# EAGLE design ethernet (EAGLE 9.6.2)

## Sheet 1 of 2: TITLE
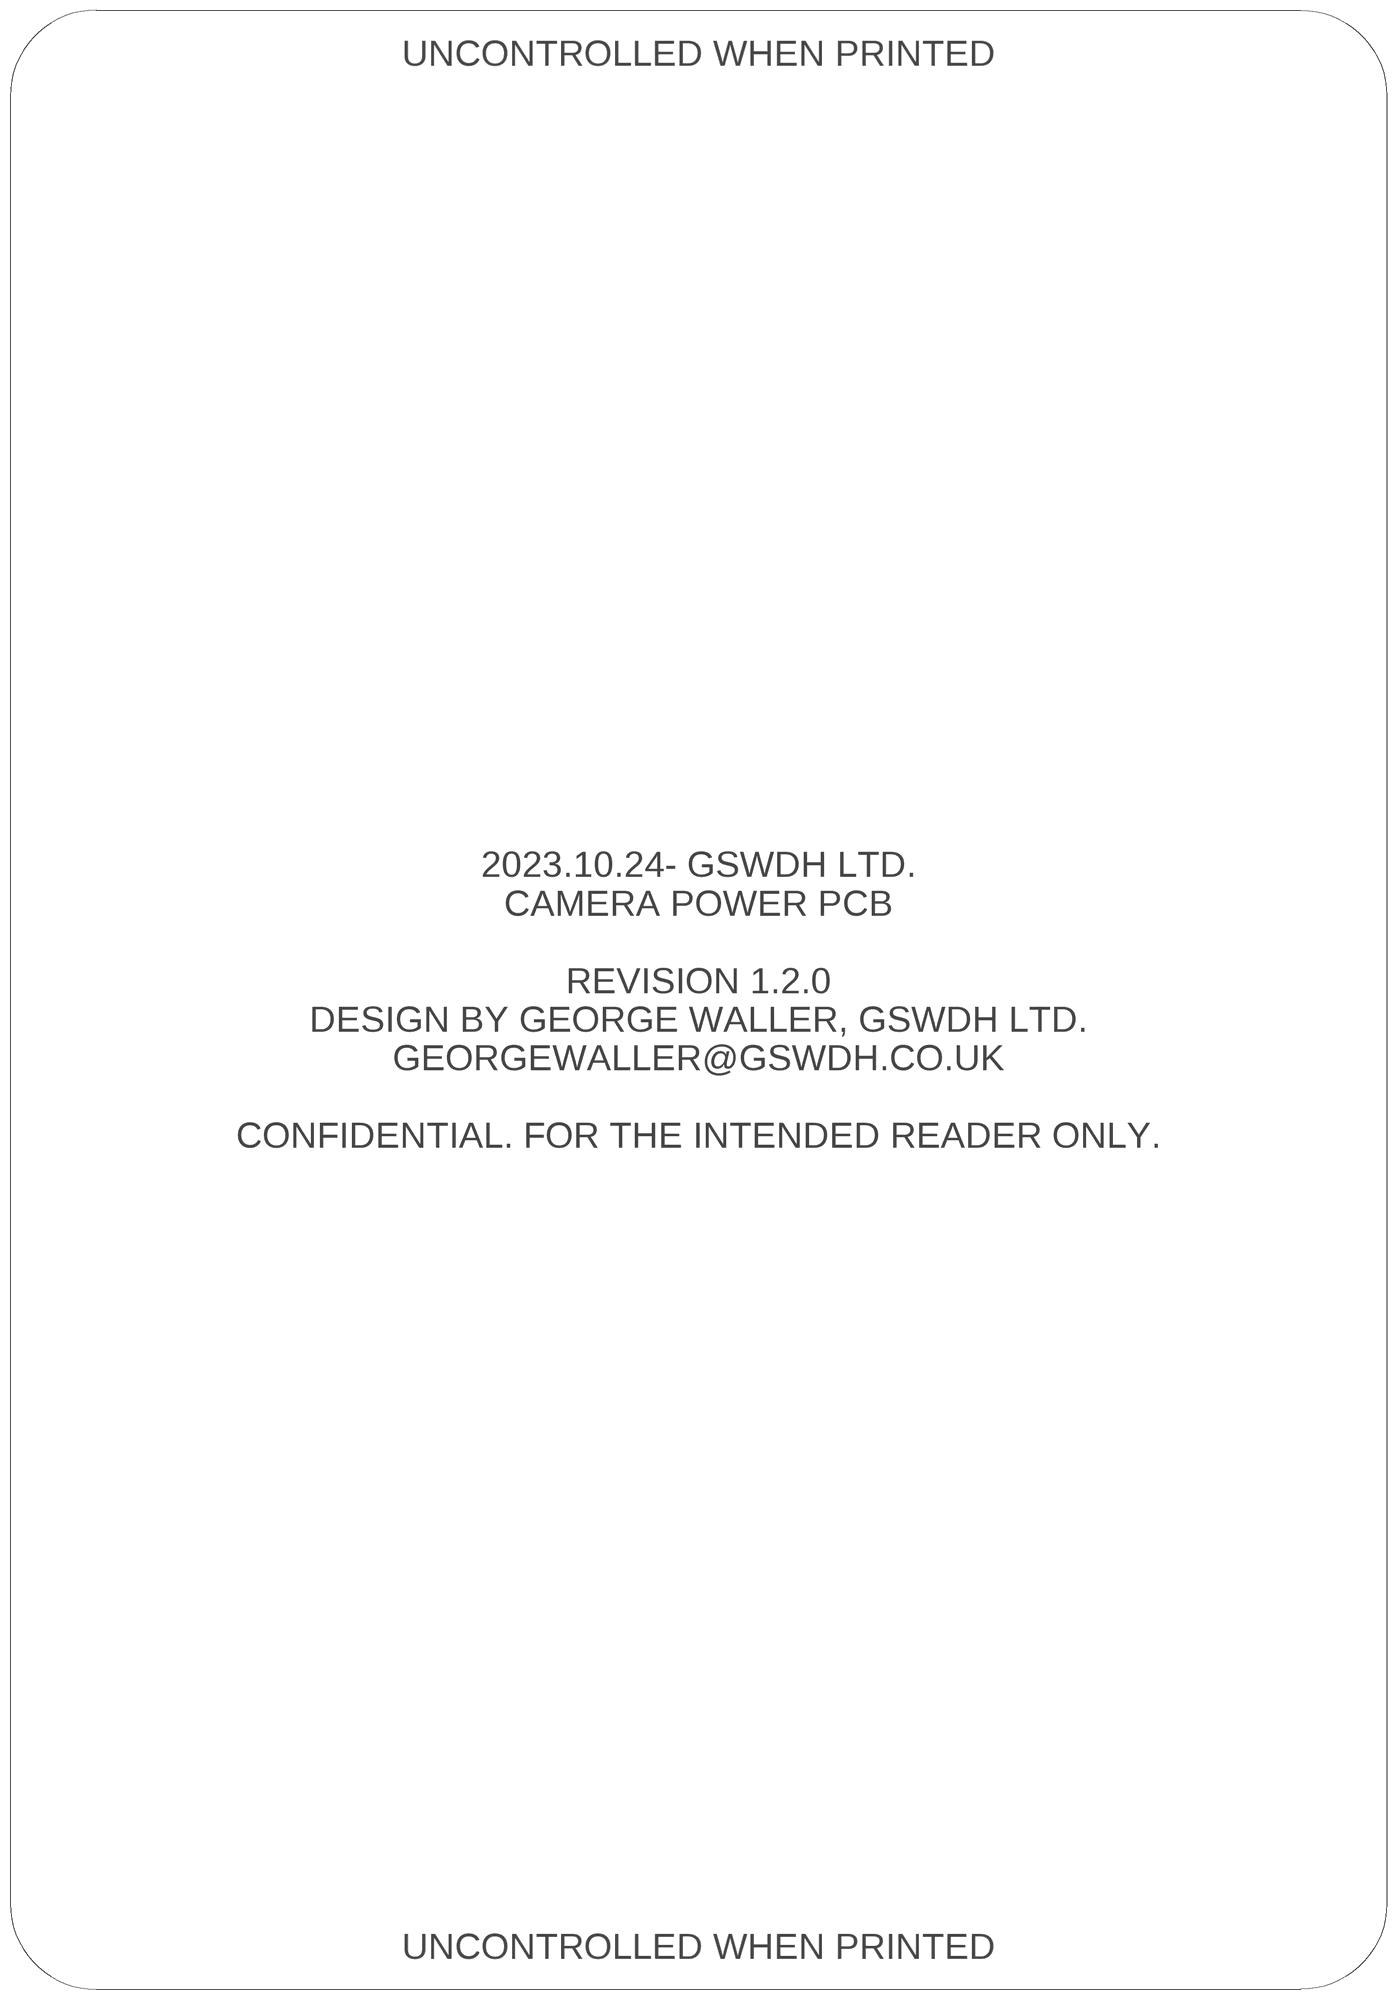
[diagram p0: schematic, sheet 1]

### Notes on the sheet
- UNCONTROLLED WHEN PRINTED
- 2023.10.24- GSWDH LTD.
  CAMERA POWER PCB
  
  REVISION 1.2.0
  DESIGN BY GEORGE WALLER, GSWDH LTD.
  GEORGEWALLER@GSWDH.CO.UK
  
  CONFIDENTIAL. FOR THE INTENDED READER ONLY.
- UNCONTROLLED WHEN PRINTED

## Sheet 2 of 2: SYSTEM_POWER
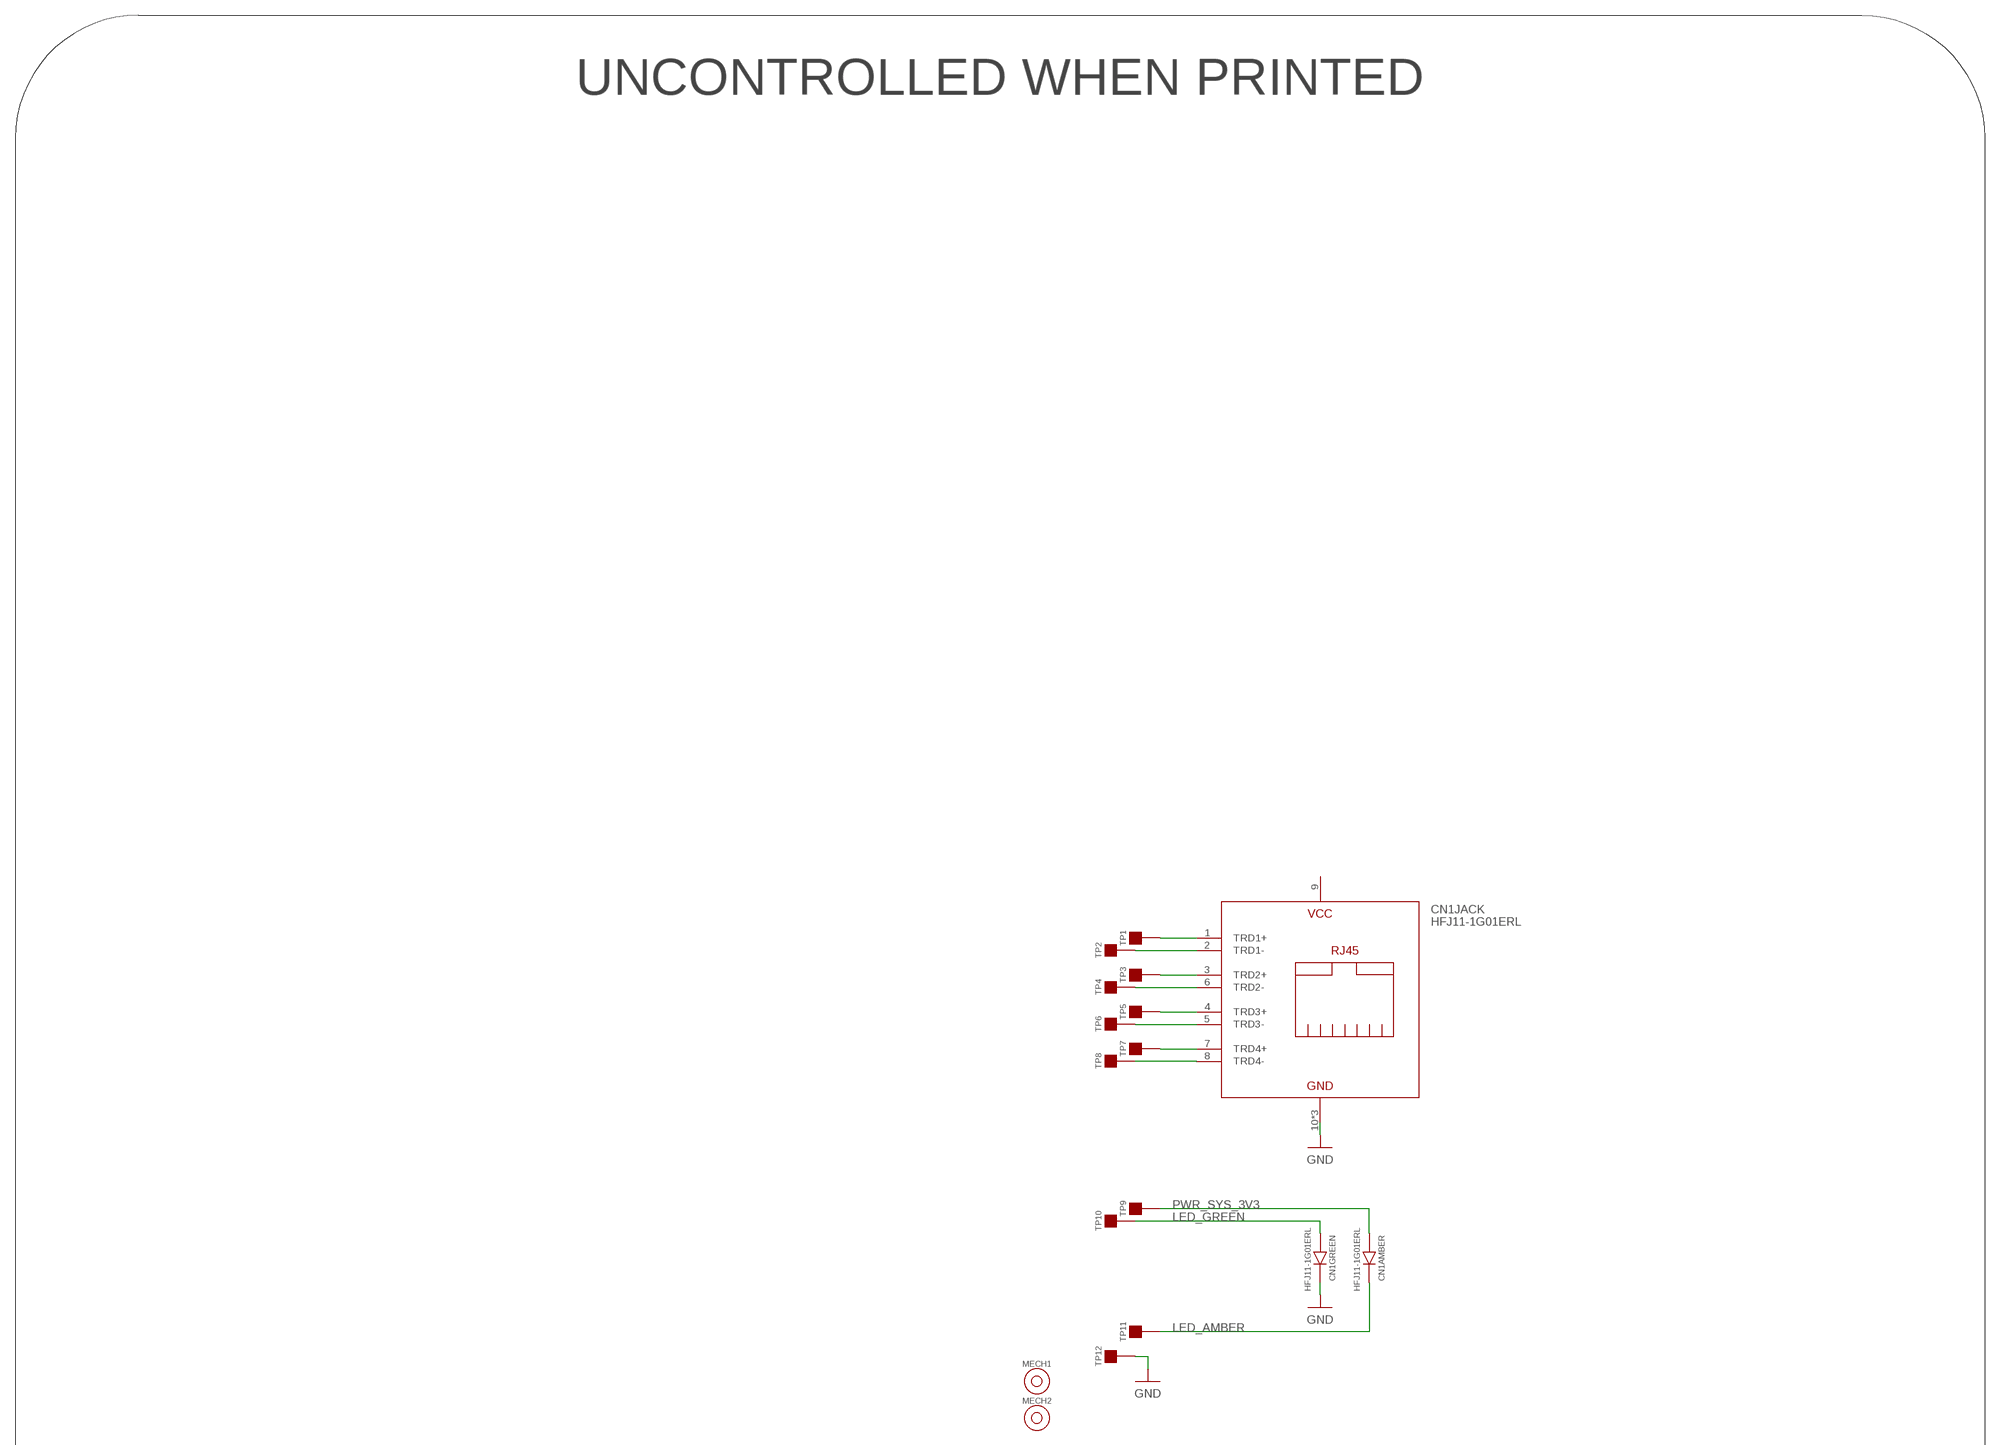
[diagram p1: schematic, sheet 2, part 1 of 2]
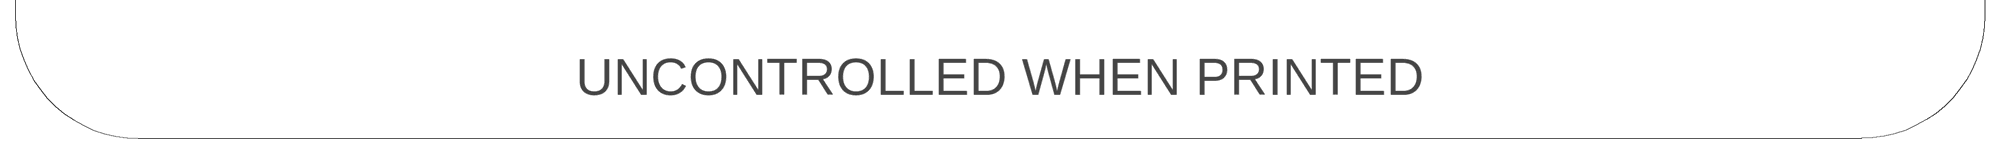
[diagram p2: schematic, sheet 2, part 2 of 2]

### Parts
CN1  HFJ11-1G01ERL  HFJ11-1G01ERL  [HFJ11-1G]
MECH1  6mm x 3mm  MOUNTHOLE  [MOUNTHOLE_6X3]
MECH2  6mm x 3mm  MOUNTHOLE  [MOUNTHOLE_6X3]
TP1  TEST_POINT_SQUARE  [OSPREY_HSS_PAD]
TP2  TEST_POINT_SQUARE  [OSPREY_HSS_PAD]
TP3  TEST_POINT_SQUARE  [OSPREY_HSS_PAD]
TP4  TEST_POINT_SQUARE  [OSPREY_HSS_PAD]
TP5  TEST_POINT_SQUARE  [OSPREY_HSS_PAD]
TP6  TEST_POINT_SQUARE  [OSPREY_HSS_PAD]
TP7  TEST_POINT_SQUARE  [OSPREY_HSS_PAD]
TP8  TEST_POINT_SQUARE  [OSPREY_HSS_PAD]
TP9  TEST_POINT_SQUARE  [OSPREY_HSS_PAD]
TP10  TEST_POINT_SQUARE  [OSPREY_HSS_PAD]
TP11  TEST_POINT_SQUARE  [OSPREY_HSS_PAD]
TP12  TEST_POINT_SQUARE  [OSPREY_HSS_PAD]

### Nets
GND: CN1.10(JACK:GND) CN1.12(GREEN:K) CN1.SH1(JACK:GND) CN1.SH2(JACK:GND) TP12.1
LED_AMBER: CN1.14(AMBER:K) TP11.1
LED_GREEN: CN1.11(GREEN:A) TP10.1
N$1: CN1.1(JACK:TRD1+) TP1.1
N$2: CN1.2(JACK:TRD1-) TP2.1
N$3: CN1.3(JACK:TRD2+) TP3.1
N$4: CN1.6(JACK:TRD2-) TP4.1
N$5: CN1.4(JACK:TRD3+) TP5.1
N$6: CN1.5(JACK:TRD3-) TP6.1
N$7: CN1.7(JACK:TRD4+) TP7.1
N$8: CN1.8(JACK:TRD4-) TP8.1
PWR_SYS_3V3: CN1.13(AMBER:A) TP9.1
Unconnected: CN1.9(JACK:VCC)

### Notes on the sheet
- UNCONTROLLED WHEN PRINTED
- UNCONTROLLED WHEN PRINTED

## Library data of the parts
CN1 = CONNECTORs:HFJ11-1G01ERL: Modular Connectors / Ethernet Connectors GIGABIT 1x1 Tab Down RJ45 w/mag No LED; HEIGHT: 16; MOUSER: 493-HFJ11-1G01ERL; PRICE_PER: 12.77
MECH1 MECH2 = MISC:MOUNTHOLE: Mechanical mounting hole.
TP1-TP12 = MISC:TEST_POINT_SQUARE: A square pad initially made for the HSS wiring

## Net classes
1 USB: width 0.25 mm, drill 0.25 mm, clearance 1 mm

## Board
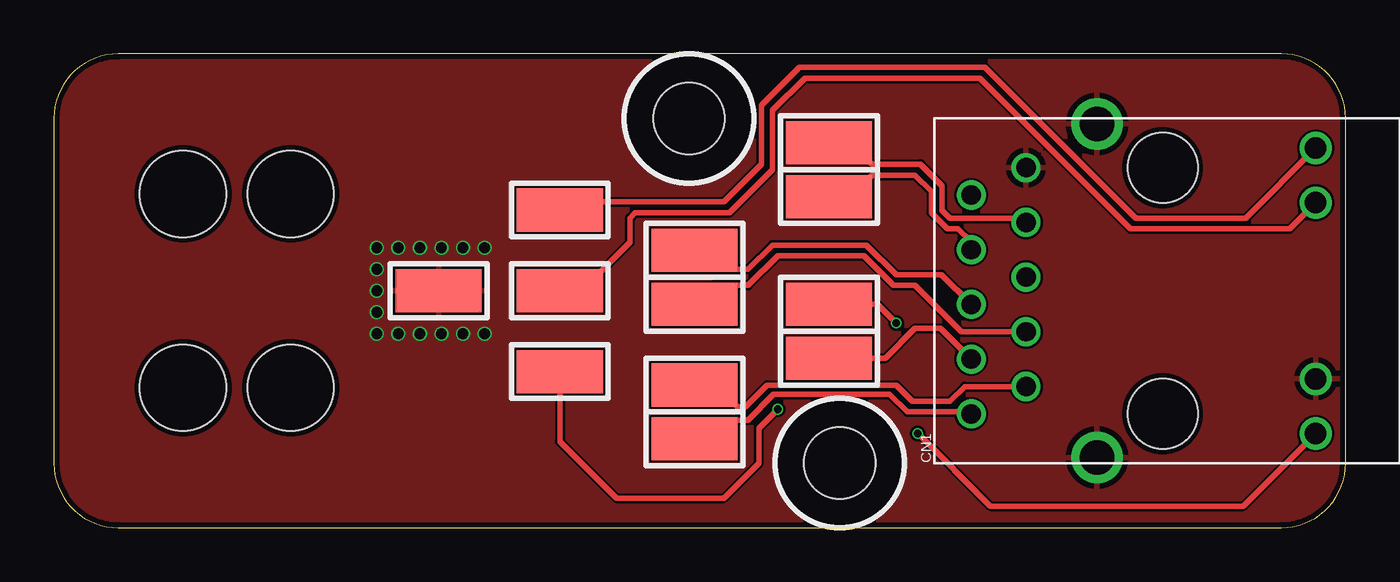
[diagram p3: board, top side]
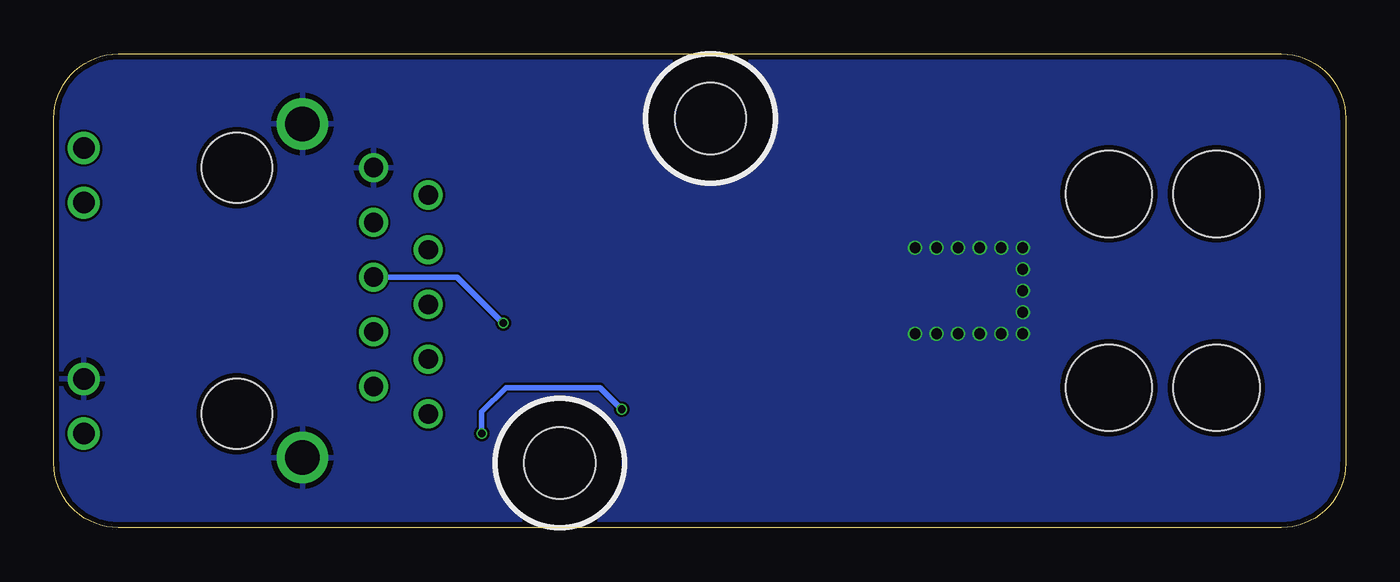
[diagram p4: board, bottom side, seen from below]

Size 60 x 22 mm. Coordinates in mm from the lower left corner, seen from the top.
Outline: 57,0 arc90 60,3 60,19 arc90 57,22 3,22 arc90 0,19 0,3 arc90 3,0 57,0
Copper layers (1*2*3*4*5*6*7*16): Top 0.035mm / dielectric 0.27mm / GND 0.035mm / dielectric 0.15mm / PWR1 0.035mm / dielectric 0.2mm / PWR2 0.035mm / dielectric 0.15mm / SIGNAL 0.035mm / dielectric 0.2mm / Route6 0.035mm / dielectric 0.15mm / Route7 0.035mm / dielectric 0.2mm / Bottom 0.035mm
Design rules "myDRC 8 layers 0.1016mm": minimum track width 4mil, minimum drill 0.2mm, track to track 4mil, track to pad 4mil, pad to pad 4mil, via to via 4mil, smd to smd 0mil, copper to edge 0.25mm, drill to drill 0.25mm, minimum pad ring 3mil, minimum via ring 3mil, stop-mask expansion 4mil, vias tented up to drill 1mm, thermal gap 10mil
Holes 4 mm at 11,15.5 11,6.5 6,15.5 6,6.5

### Footprints (pad centres in the part's own frame; a part is rotated, then mirrored left to right if it is on the bottom)
HFJ11-1G = drill 0.9: 1 -5.715,8.89; 2 -4.445,6.35; 3 -3.175,8.89; 4 -1.905,6.35; 5 -0.635,8.89; 6 0.635,6.35; 7 1.905,8.89; 8 3.175,6.35; 9 4.445,8.89; 10 5.715,6.35 | drill 1: 11 -6.63,-7.11; 12 -4.09,-7.11; 13 4.09,-7.11; 14 6.63,-7.11 | drill 1.6: SH1 -7.745,3.05; SH2 7.745,3.05 | hole 3.25: 5.715,0; -5.715,0
MOUNTHOLE_6X3 = hole 3.3: 0,0
OSPREY_HSS_PAD = smd 4 x 2: 1 0,0

### Placement (x,y rotation side)
CN1  51.5,11 90 top
MECH1  29.5,19 0 top
MECH2  36.5,3 0 top
TP1  29.75,4.12 0 top
TP2  29.75,6.62 0 top
TP3  36,7.88 0 top
TP4  36,10.38 0 top
TP5  29.75,10.38 0 top
TP6  29.75,12.88 0 top
TP7  36,15.38 0 top
TP8  36,17.88 0 top
TP9  23.5,11 0 top
TP10  23.5,7.25 0 top
TP11  23.5,14.75 0 top
TP12  17.88,11 0 top

### Tracks (layer width: path | path; a pad name or v marks a point on that pad's centre or on a via)
GND  (via drill 0.5)
  other vias: 15,13 16,13 17,13 18,13 19,13 20,13 15,12 15,11 15,10 15,9 16,9 17,9 18,9 19,9 20,9
  pour Bottom: 28.5,0 60,0 60,11.75 60,22 46.38,22 0,22 0,9 0,0
  pour Top: 28.5,0 60,0 60,11.75 60,22 46.38,22 0,22 0,9 0,0
LED_AMBER
  Top 0.25: TP11.1 23.88,15.12 31.12,15.12 32.88,16.88 32.88,19.62 34.62,21.38 43.25,21.38 50.25,14.38 55.36,14.38 CN1.14
LED_GREEN  (via drill 0.35)
  Top 0.25: TP10.1 23.5,4 26.12,1.38 31.12,1.38 32.75,3 32.75,4.62 v33.62,5.5 | v40.12,4.38 43.5,1 55.24,1 CN1.11
  Bottom 0.25: v33.62,5.5 34.62,6.5 39,6.5 40.12,5.38 v40.12,4.38
N$1
  Top 0.25: TP1.1 30.62,5 32.24,5 33.43,6.19 38.82,6.19 39.63,5.38 41.38,5.38 42.52,5.38 CN1.1
N$2
  Top 0.25: TP2.1 30.75,6.62 31.75,5.62 32.12,5.62 33.12,6.62 39.12,6.62 39.88,5.88 41.62,5.88 42.3,6.55 CN1.2
N$3
  Top 0.25: TP3.1 38.62,7.88 40,9.25 41.19,9.25 CN1.3
N$4  (via drill 0.35)
  Top 0.25: TP4.1 38.25,10.38 v39.12,9.5
  Bottom 0.25: v39.12,9.5 41.26,11.63 CN1.6
N$5
  Top 0.25: TP5.1 30.62,11.25 32.25,11.25 33.62,12.62 37.62,12.62 39,11.25 40,11.25 42.16,9.1 CN1.4
N$6
  Top 0.25: TP6.1 30.62,12 32.25,12 33.38,13.12 37.75,13.12 39.12,11.75 41.23,11.75 CN1.5
N$7
  Top 0.25: TP7.1 37,15.38 38,16.38 40,16.38 40.75,15.62 40.75,14.62 41.5,13.88 42,13.88 42.61,13.27 CN1.7
N$8
  Top 0.25: TP8.1 37,17.88 38,16.88 40.25,16.88 41.25,15.88 41.25,14.75 41.62,14.38 44.95,14.38 CN1.8
PWR_SYS_3V3
  Top 0.25: CN1.13 57.39,13.88 50,13.88 43,20.88 34.88,20.88 33.38,19.38 33.38,16.62 31.38,14.62 27,14.62 26.75,14.38 26.75,13.25 24.5,11 TP9.1